# Altium schematic sheet EN-C200_RA0_PWR_只有元器件.SchDoc
size A4
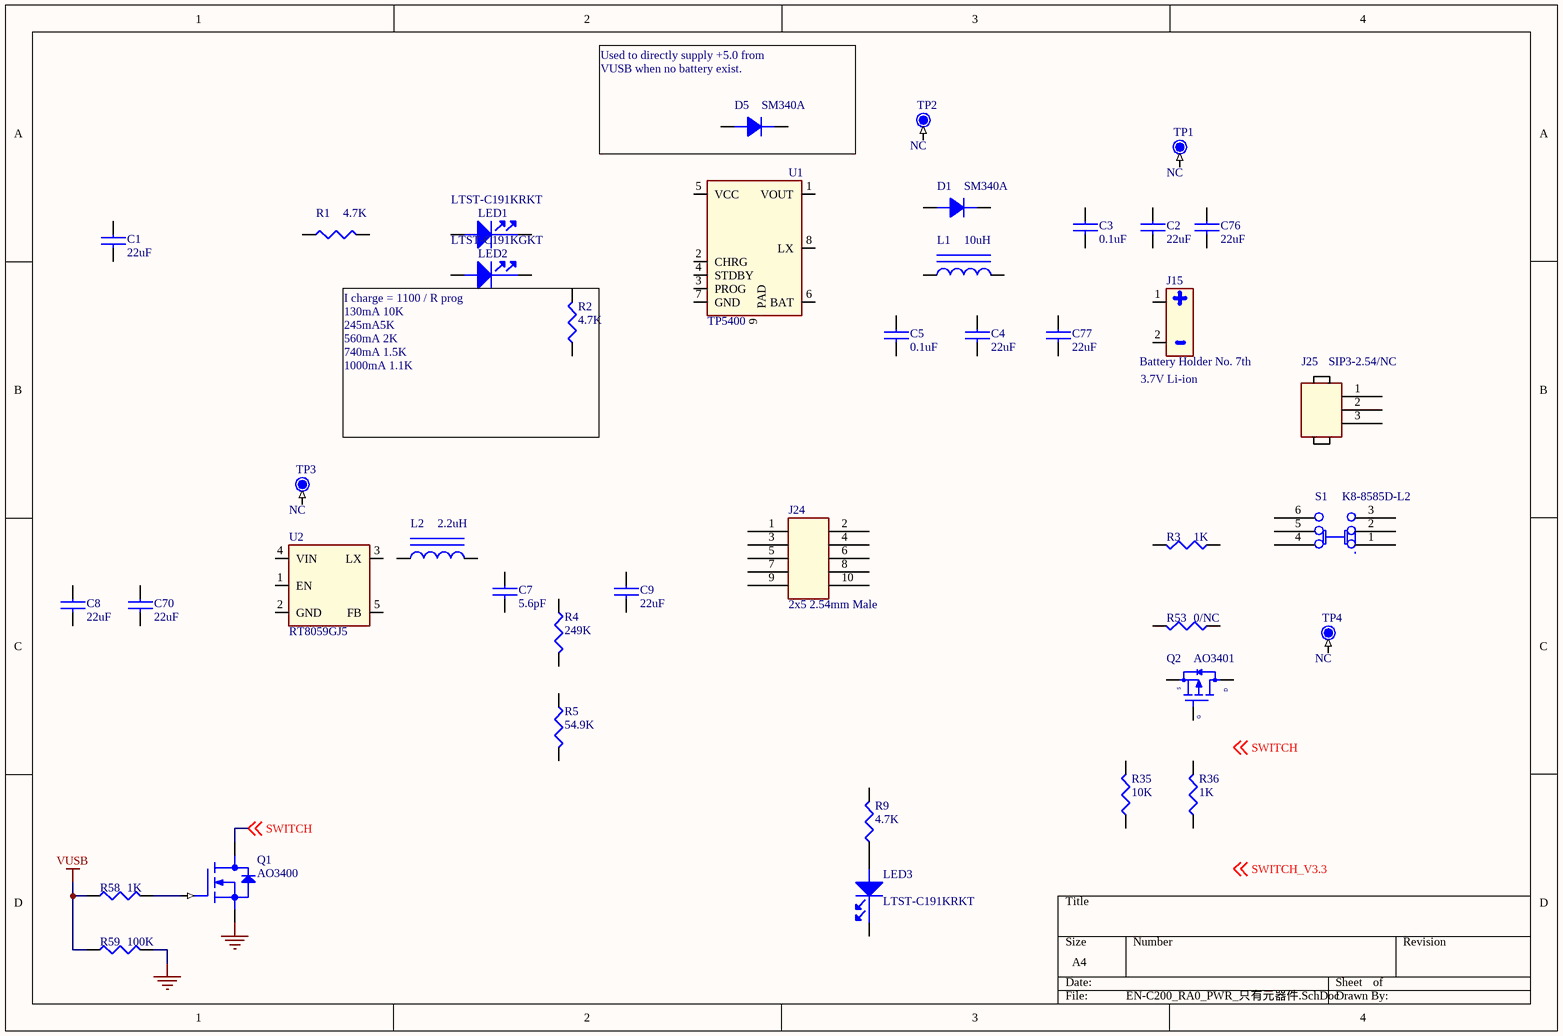
[diagram p0: EN-C200_RA0_PWR_只有元器件.SchDoc]

## Parts
C1  22uF  [SC0805]
C2  22uF  [SC0805]
C3  0.1uF  [SC0603]
C4  22uF  [SC0805]
C5  0.1uF  [SC0603]
C7  5.6pF  [SC0603]
C8  22uF  [SC0805]
C9  22uF  [SC0805]
C70  22uF  [SC0805]
C76  22uF  [SC0805]
C77  22uF  [SC0805]
D1  SM340A  [SD1714]
D5  SM340A  [SD1714]
J15  Battery Holder No. 7th  [BX0034]
J24  2x5 2.54mm Male  [SIP-2X5P-100]
J25  SIP3-2.54/NC  [SIP-3P]
L1  10uH  [SPL0505B]
L2  2.2uH  [SL1008]
LED1  LTST-C191KRKT  [HSD0603-LED]
LED2  LTST-C191KGKT  [HSD0603-LED]
LED3  LTST-C191KRKT  [HSD0603-LED]
Q1  AO3400  [SOT23]
Q2  AO3401  [SOT23]
R1  4.7K  [SR0603]
R2  4.7K  [SR0603]
R3  1K  [SR0603]
R4  249K  [SR0603]
R5  54.9K  [SR0603]
R9  4.7K  [SR0603]
R35  10K  [SR0603]
R36  1K  [SR0603]
R53  0/NC  [SR0603]
R58  1K  [SR0603]
R59  100K  [SR0603]
S1  K8-8585D-L2  [SW2X3-100]
TP1  NC  [TP32-SMD]
TP2  NC  [TP32-SMD]
TP3  NC  [TP32-SMD]
TP4  NC  [TP32-SMD]
U1  TP5400  [SOP8-50-150B]
U2  RT8059GJ5  [SOT23-5]

## Nets
GND: Q1.2(S) R59.2
VUSB: R58.1 R59.1
SWITCH: Q1.3(D) ; off-sheet SWITCH
NetLED3_1: LED3.1 R9.1
NetQ1_1: Q1.1(G) R58.2

Not connected (* = marked no-connect by the designer): C1 1 2; C2 1 2; C3 1 2; C4 1 2; C5 1 2; C7 1 2; C8 1 2; C9 1 2; C70 1 2; C76 1 2; C77 1 2; D1 1(A) 2(K); D5 1(A) 2(K); J15 1 2; J24 1 2 3 4 5 6 7 8 9 10; J25 1 2 3; L1 1 2; L2 1 2; LED1 1 2; LED2 1 2; LED3 2; Q2 1(G) 2(S) 3(D); R1 1 2; R2 1 2; R3 1 2; R4 1 2; R5 1 2; R9 2; R35 1 2; R36 1 2; R53 1 2; S1 1 2 3 4 5 6; TP1 1; TP2 1; TP3 1; TP4 1; U1 1(VOUT) 2(CHRG) 3(PROG) 4(STDBY) 5(VCC) 6(BAT) 7(GND) 8(LX) 9(PAD); U2 1(EN) 2(GND) 3(LX) 4(VIN) 5(FB)

## Notes on the sheet
- (near D5) Used to directly supply +5.0 from
  VUSB when no battery exist.
- (near R2) I charge = 1100 / R prog
  130mA 10K
  245mA5K
  560mA 2K
  740mA 1.5K
  1000mA 1.1K
- (near J15) 3.7V Li-ion
- Labels drawn without touching a wire or pin: SWITCH, SWITCH_V3.3

## Library data of the parts
C1-C5 C7-C9 C70 C76 C77 = CAP NP
D1 D5 = DIODE
J15 = BX0034
J24 = CON10A
J25 = HEADER3
L1 L2 = TOROID IRON
LED1-LED3 = LED
Q1 = MPF6661
Q2 = A03401
R1-R5 R9 R35 R36 R53 R58 R59 = RESISTOR
S1 = SW_PUSH6: SDTSourceLibName: C:\WIND95\TEMP\6200.LIB
TP1-TP4 = TP
U2 = RT8059